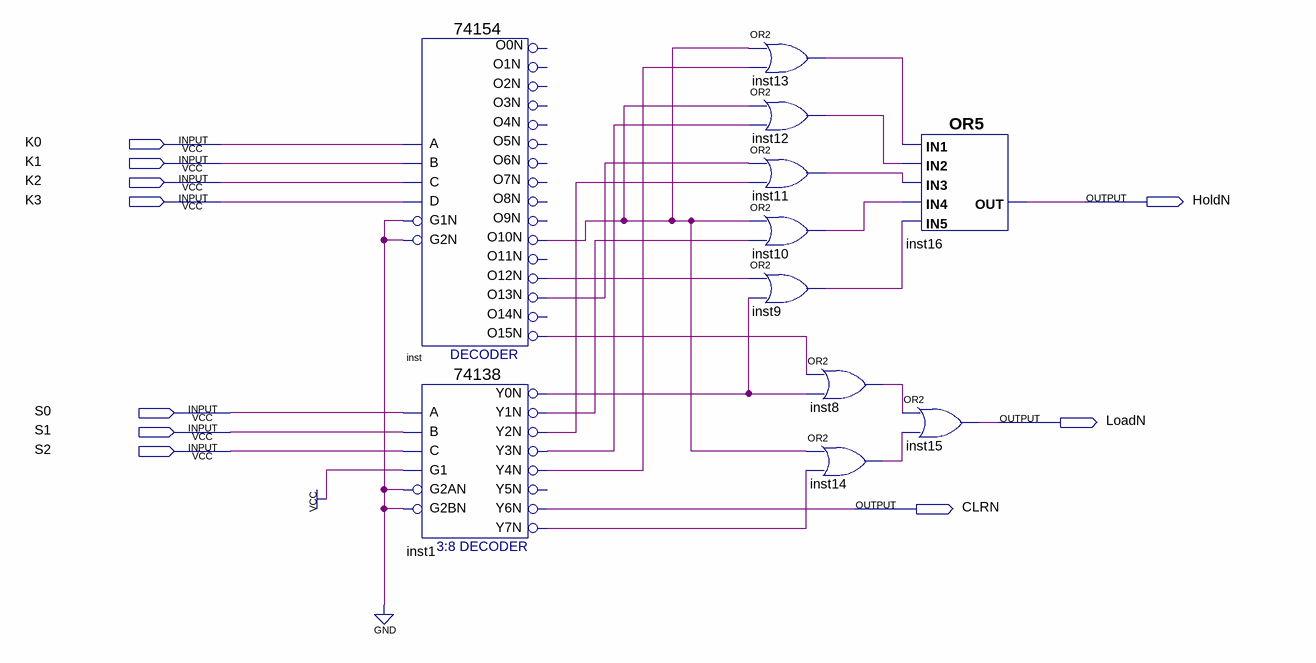
[diagram p0: schematic sheet]
// Quartus schematic MainStatusJudger.bdf as structural Verilog: 11 symbols, 10 pins
module MainStatusJudger (
  input  K0,
  input  K1,
  input  K2,
  input  K3,
  input  S0,
  input  S1,
  input  S2,
  output HoldN,
  output LoadN,
  output CLRN
);

  wire inst1_y0n, inst1_y1n, inst1_y2n, inst1_y3n, inst1_y4n, inst1_y7n, inst8_out, inst9_out, inst10_out,
       inst11_out, inst12_out, inst13_out, inst14_out, inst_o10n, inst_o12n, inst_o13n, inst_o15n;

  \74154  inst (
    .C(K2), .D(K3), .B(K1), .A(K0), .G1N(1'b0), .G2N(1'b0), .O12N(inst_o12n), .O15N(inst_o15n),
    .O10N(inst_o10n), .O13N(inst_o13n));  // open: O0N, O11N, O1N, O14N, O4N, O3N, O2N, O7N, O6N, O5N, O9N, O8N
  \74138  inst1 (
    .A(S0), .B(S1), .G1(1'b1), .C(S2), .G2AN(1'b0), .G2BN(1'b0), .Y0N(inst1_y0n), .Y1N(inst1_y1n),
    .Y2N(inst1_y2n), .Y3N(inst1_y3n), .Y4N(inst1_y4n), .Y6N(CLRN), .Y7N(inst1_y7n));  // open: Y5N
  or inst13 (inst13_out, inst_o10n, inst1_y4n);
  or inst12 (inst12_out, inst_o10n, inst1_y3n);
  or inst11 (inst11_out, inst_o13n, inst1_y2n);
  or inst10 (inst10_out, inst_o10n, inst1_y1n);
  or inst9 (inst9_out, inst_o12n, inst1_y0n);
  or inst8 (inst8_out, inst_o15n, inst1_y0n);
  or inst14 (inst14_out, inst_o10n, inst1_y7n);
  or inst16 (HoldN, inst13_out, inst12_out, inst11_out, inst10_out, inst9_out);
  or inst15 (LoadN, inst8_out, inst14_out);
endmodule
